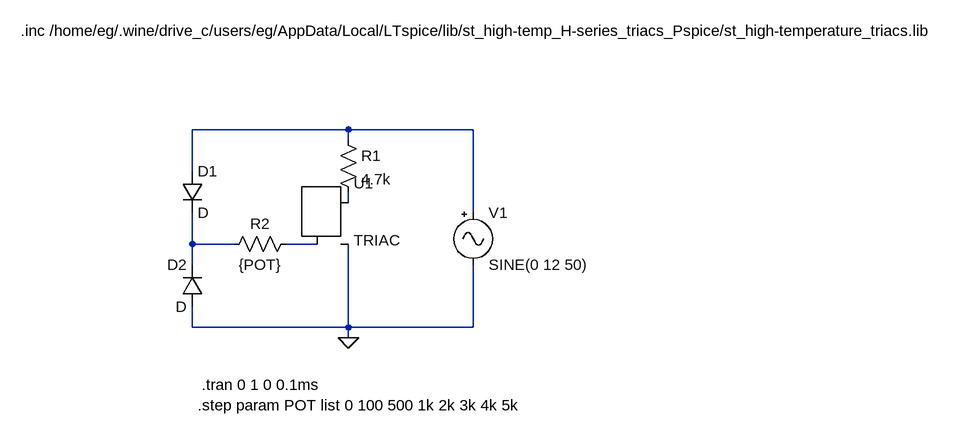
[diagram p0: schematic SextaParteD.asc]
SextaParteD.asc, the LTspice schematic file:
Version 4
SHEET 1 1516 680
WIRE 416 208 176 208
WIRE 608 208 416 208
WIRE 416 224 416 208
WIRE 176 272 176 208
WIRE 416 320 416 304
WIRE 608 336 608 208
WIRE 176 384 176 336
WIRE 240 384 176 384
WIRE 368 384 320 384
WIRE 176 416 176 384
WIRE 176 512 176 480
WIRE 416 512 416 384
WIRE 416 512 176 512
WIRE 608 512 608 416
WIRE 608 512 416 512
WIRE 416 528 416 512
FLAG 416 528 0
SYMBOL Misc\\TRIAC 384 320 R0
SYMATTR InstName U1
SYMBOL res 400 208 R0
SYMATTR InstName R1
SYMATTR Value 4.7k
SYMBOL res 336 368 R90
WINDOW 0 0 56 VBottom 2
WINDOW 3 32 56 VTop 2
SYMATTR InstName R2
SYMATTR Value {POT}
SYMBOL diode 160 272 R0
SYMATTR InstName D1
SYMBOL diode 192 480 R180
WINDOW 0 24 64 Left 2
WINDOW 3 24 0 Left 2
SYMATTR InstName D2
SYMBOL Misc\\signal 608 320 R0
WINDOW 123 0 0 Left 0
WINDOW 39 0 0 Left 0
SYMATTR InstName V1
SYMATTR Value SINE(0 12 50)
TEXT -88 56 Left 2 !.inc /home/eg/.wine/drive_c/users/eg/AppData/Local/LTspice/lib/st_high-temp_H-series_triacs_Pspice/st_high-temperature_triacs.lib
TEXT 190 600 Left 2 !.tran 0 1 0 0.1ms
TEXT 184 632 Left 2 !.step param POT list 0 100 500 1k 2k 3k 4k 5k

The netlist it stands for:
* SextaParteD.asc
XU1 N002 N004 0 TRIAC  ; pins MT2 G MT1
R1 N001 N002 4.7k
R2 N004 N003 {POT}
D1 N001 N003 D
D2 0 N003 D
V1 N001 0 SINE(0 12 50)
.model D D
.lib standard.dio
.inc /home/eg/.wine/drive_c/users/eg/AppData/Local/LTspice/lib/st_high-temp_H-series_triacs_Pspice/st_high-temperature_triacs.lib
.tran 0 1 0 0.1ms
.step param POT list 0 100 500 1k 2k 3k 4k 5k
.backanno
.end